# EAGLE schematic door-strike-schematic (EAGLE 7.2.0)
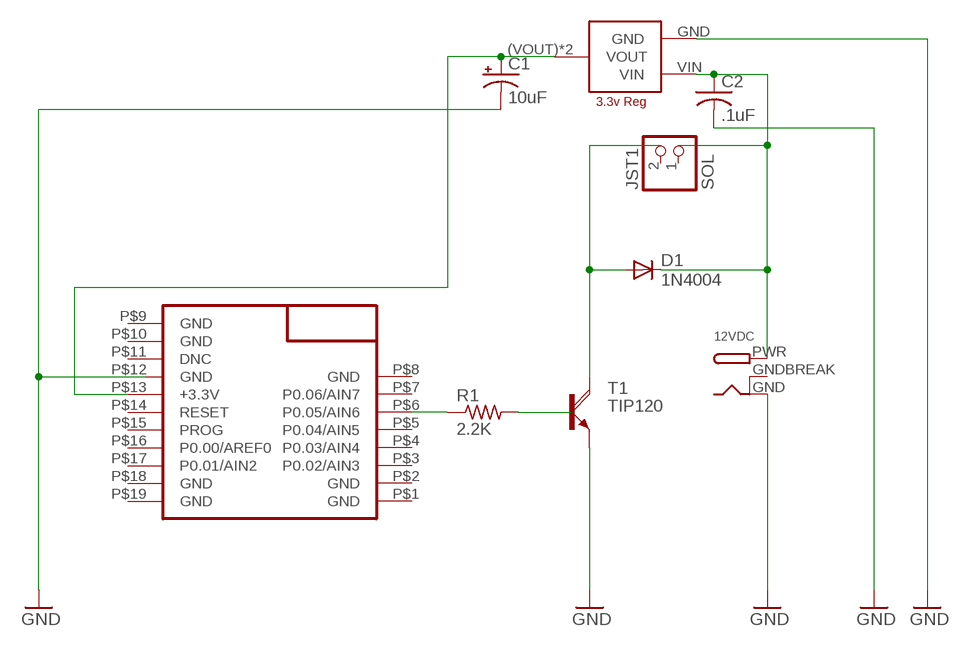
[diagram p0: schematic, sheet 1]

## Parts
12VDC  DCBARRELPTH  [DCJACK_2MM_PTH]
C1  10uF  CPOL-USE2-5  [E2-5]
C2  .1uF  C-US102-054X133  [C102-054X133]
D1  1N4004  [DO41-10]
JST1  SOL  JST_2PIN-THM  [JST-PH-2-THM]
R1  2.2K  R-US_0207/7  [0207/7]
T1  TIP120  [TO220AH]
U$1  LD1117  [LD1117SOT-223]
U$2  RFD22301  [RFD21733]

## Nets
GND: 12VDC.GND C1.- C2.2 T1.E U$1.GND
N$1: R1.1 U$2.P$6(P0.05/AIN6)
N$2: R1.2
N$6: D1.A T1.C
N$7: C1.+ U$1.(VOUT)(VOUT) U$1.VOUT U$2.P$13(+3.3V)
N$8: 12VDC.PWR C2.1 D1.C U$1.VIN
Unconnected: JST1.1 JST1.2 T1.B U$2.P$1(GND) U$2.P$2(GND) U$2.P$3(P0.02/AIN3) U$2.P$4(P0.03/AIN4) U$2.P$5(P0.04/AIN5) U$2.P$7(P0.06/AIN7) U$2.P$8(GND) U$2.P$9(GND) U$2.P$10(GND) U$2.P$11(DNC) U$2.P$12(GND) U$2.P$14(RESET) U$2.P$15(PROG) U$2.P$16(P0.00/AREF0) U$2.P$17(P0.01/AIN2) U$2.P$18(GND) U$2.P$19(GND)

## Power pins joined to a net without a drawn wire
GNDBREAK: 12VDC.GNDBREAK

## Library data of the parts
12VDC = adafruit:DCBARREL: 2.0mm DC Barrel Jack DCJACK_2MM_PTH - Through Hole Jack (4UConnector: 05537)
C1 = adafruit:CPOL-US: POLARIZED CAPACITOR, American symbol
C2 = adafruit:C-US: CAPACITOR, American symbol
D1 = adafruit:1N4004: DIODE General purpose 1N400x type rectifier (With bigger pads) http://www.ladyada.net/library/pcb/eaglelibrary.html
JST1 = adafruit:JST_2PIN: JST 2-Pin Connectors of various flavors SMT-RA (S2B-PH-SM4) 4UConnector #17311 SMT (B2B-PH-SM4) THM-RA (S2B-PH) THM (B2B-PH)
R1 = resistor:R-US_: RESISTOR, American symbol
T1 = transistor-power:TIP120: NPN DARLINGTON TRANSISTOR
U$1 = LD1117:LD1117
U$2 = RFD22301-11.25.13:RFD22301: RF Digital RFD22301